# Altium schematic sheet POWER.SchDoc
size A4; SheetNumber: 3; SheetTotal: 4
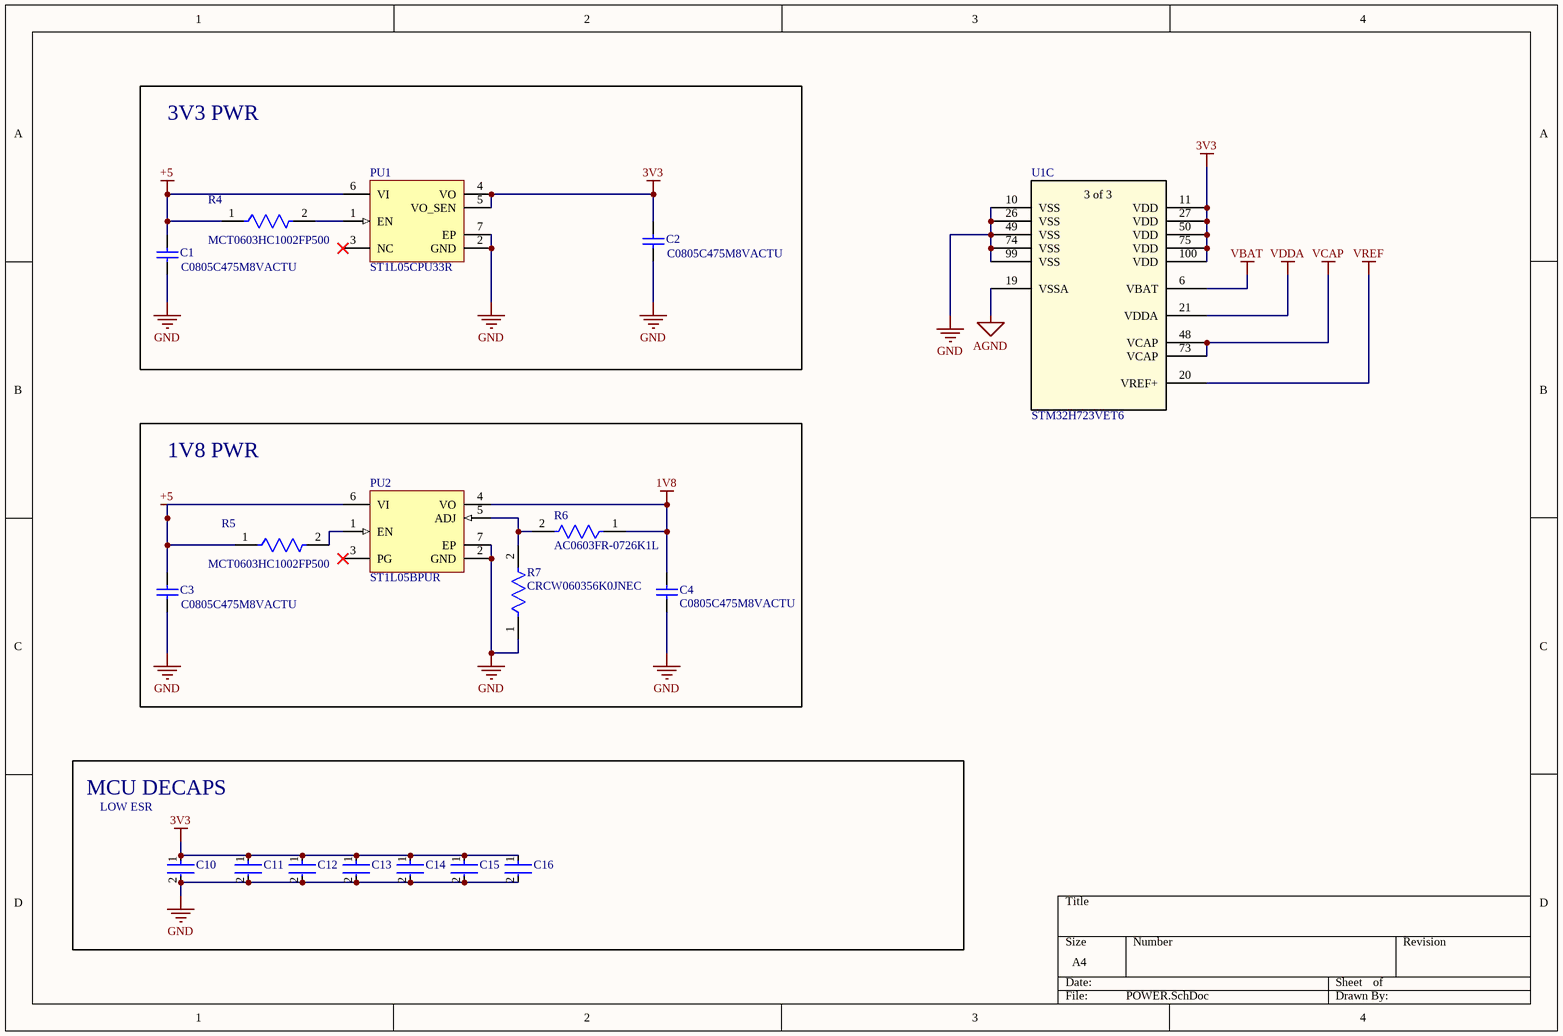
[diagram p0: POWER.SchDoc]

## Parts
C1  C0805C475M8VACTU  [CAPC2013X145X50ML20T25]
C2  C0805C475M8VACTU  [CAPC2013X145X50ML20T25]
C3  C0805C475M8VACTU  [CAPC2013X145X50ML20T25]
C4  C0805C475M8VACTU  [CAPC2013X145X50ML20T25]
C10  C0603X6S1C104K030BC  [FP-C0603-030-0_03-IPC_B]  (value not drawn)
C11  C0603X6S1C104K030BC  [FP-C0603-030-0_03-IPC_B]  (value not drawn)
C12  C0603X6S1C104K030BC  [FP-C0603-030-0_03-IPC_B]  (value not drawn)
C13  C0603X6S1C104K030BC  [FP-C0603-030-0_03-IPC_B]  (value not drawn)
C14  C0603X6S1C104K030BC  [FP-C0603-030-0_03-IPC_B]  (value not drawn)
C15  C0603X6S1C104K030BC  [FP-C0603-030-0_03-IPC_B]  (value not drawn)
C16  C0603X6S1C104K030BC  [FP-C0603-030-0_03-IPC_B]  (value not drawn)
PU1  ST1L05CPU33R  [DFN6D_N]
PU2  ST1L05BPUR  [DFN6D_M]
R4  MCT0603HC1002FP500  [FP-MCT0603-IPC_B]
R5  MCT0603HC1002FP500  [FP-MCT0603-IPC_B]
R6  AC0603FR-0726K1L  [FP-AC0603-MFG]
R7  CRCW060356K0JNEC  [FP-CRCW0603-e3-IPC_A]
U1  STM32H723VET6  [LQFP100_STM]  (part C of 3)

## Blocks framed on the sheet
3V3 PWR: C1 C2 PU1 R4
1V8 PWR: C3 C4 PU2 R5-R7
MCU DECAPS: C10-C16

## Nets
1V8: C4.2 PU2.4(VO) R6.1
3V3: C2.2 C10.1 C11.1 C12.1 C13.1 C14.1 C15.1 C16.1 PU1.4(VO) PU1.5(VO_SEN) U1.11(VDD) U1.27(VDD) U1.50(VDD) U1.75(VDD) U1.100(VDD)
+5: C1.2 C3.2 PU1.6(VI) PU2.6(VI) R4.1 R5.1
AGND: U1.19(VSSA)
GND: C1.1 C2.1 C3.1 C4.1 C10.2 C11.2 C12.2 C13.2 C14.2 C15.2 C16.2 PU1.2(GND) PU1.7(EP) PU2.2(GND) PU2.7(EP) R7.1 U1.10(VSS) U1.26(VSS) U1.49(VSS) U1.74(VSS) U1.99(VSS)
VBAT: U1.6(VBAT)
VCAP: U1.48(VCAP) U1.73(VCAP)
VDDA: U1.21(VDDA)
VREF: U1.20(VREF+)
NetPU1_1: PU1.1(EN) R4.2
NetPU2_1: PU2.1(EN) R5.2
NetPU2_5: PU2.5(ADJ) R6.2 R7.2

Not connected (* = marked no-connect by the designer): PU1 3(NC)*; PU2 3(PG)*

## Notes on the sheet
- LOW ESR
- (in symbol STM32H723VET6, part C) 3 of 3

## Library data of the parts
C1-C4 = CMP-2007-01267-1: Manufacturer: Kemet; Part Number: C0805C475M8VACTU
C10-C16 = CMP-08246-003275-1: Multilayer Ceramic Capacitors 100nF ±10% 16V X6S SMD 0201; Max Operating Temperature: 105°C; Tolerance: 10%; Termination: SMD/SMT; Mount: Surface Mount; Case Code (Imperial): 0201; Package Quantity: 1; RoHS Compliant: Yes; Voltage Rating (DC): 16V; Capacitance: 100nF; REACH SVHC: No SVHC; Lead Free: Lead Free; Min Operating Temperature: -55°C; Dielectric Material: Ceramic; Dielectric: X6S; Case/Package: 0201; Length: 0.024inch; Weight: 6E-06oz; Case Code (Metric): 0603; Width: 0.3mm; Voltage Rating: 16V; Height: 0.3mm; Packaging: Tape and Reel; Thickness: 0.013inch
PU1 = CMP-0244-00293-1: Very Low Quiescent BiCMOS Voltage Regulator, 3.3V, 6-Pin VFDFPN, Tape and Reel; ComponentLink2Description: Datasheet; ComponentLink1Description: Manufacturer URL; ComponentLink2URL: http://www.st.com/internet/com/TECHNICAL_RESOURCES/TECHNICAL_LITERATURE/DATASHEET/CD00186925.pdf; PackageVersion: 2008; PackageReference: DFN6D; PackageDescription: 6-Pin Plastic, Dual LLP, 3 x 3 mm Body, 0.95 mm Pitch, Exposed Pad; DatasheetVersion: 1/09/2009; ComponentLink1URL: http://www.st.com
PU2 = CMP-0244-00292-1: Very Low Quiescent BiCMOS Voltage Regulator, Adjustable Vo, 6-Pin VFDFPN, Tape and Reel; PackageDescription: 6-Pin Plastic, Dual LLP, 3 x 3 mm Body, 0.95 mm Pitch, Exposed Pad; ComponentLink2Description: Datasheet; ComponentLink2URL: http://www.st.com/internet/com/TECHNICAL_RESOURCES/TECHNICAL_LITERATURE/DATASHEET/CD00186925.pdf; ComponentLink1Description: Manufacturer URL; DatasheetVersion: 1/09/2009; PackageReference: DFN6D; PackageVersion: 2008; ComponentLink1URL: http://www.st.com
R4 R5 = CMP-02407-001090-1: RES SMD 100 OHM 1% 1/8W 0603
R6 = CMP-03412-013200-2: RES 26.1KΩ 1.00% 0.1W 0603; Power Rating: 100mW; Temperature Coefficient: 100ppm/°C; Resistance: 26.1kR; Voltage Rating: 50V; Tolerance: 1%; Length: 0.063inch; Height: 0.022inch; Max Operating Temperature: 155°C; Width: 0.8mm; Weight: 7.1E-05oz; Case/Package: 0603; Number of Terminations: 2; Resistor Type: Thick Film; Min Operating Temperature: -55°C; Max Power Dissipation: 100mW; Features: Moisture Resistant; Case Code (Metric): 1608; Packaging: Tape and Reel; RoHS Compliant: Yes; Termination: SMD/SMT; Series: AC; Case Code (Imperial): 0603
R7 = CMP-02407-010749-1: RES Thick Film, 56kΩ, 5%, 0.1W, 200ppm/°C, 0603; Max Power Dissipation: 100mW; Resistance: 56kR; Max Operating Temperature: 155°C; Features: Automotive AEC-Q200; Height: 0.02inch; Lead Free: Lead Free; Min Operating Temperature: -55°C; Packaging: Tape and Reel; Length: 0.061inch; Composition: Thick Film; Tolerance: 5%; Width: 0.033inch; Temperature Coefficient: 200ppm/°C; Case/Package: 0603; Number of Terminations: 2; Package Quantity: 20000
U1 = STM32H723VET6: High-performance and DSP with DP-FPU, Arm Cortex-M7 MCU with 512 Kbytes Flash, 564 Kbytes RAM, 550 MHz CPU, L1 cache, external memory interface, subset of peripherals; Manufacturer_Name: STMicroelectronics; Copyright: Copyright (C) 2025 Ultra Librarian. All rights reserved.; Manufacturer_Part_Number: STM32H723VET6; Datasheet: https://www.st.com/resource/en/datasheet/stm32h723ve.pdf; RefDes: RefDes; Type: Type